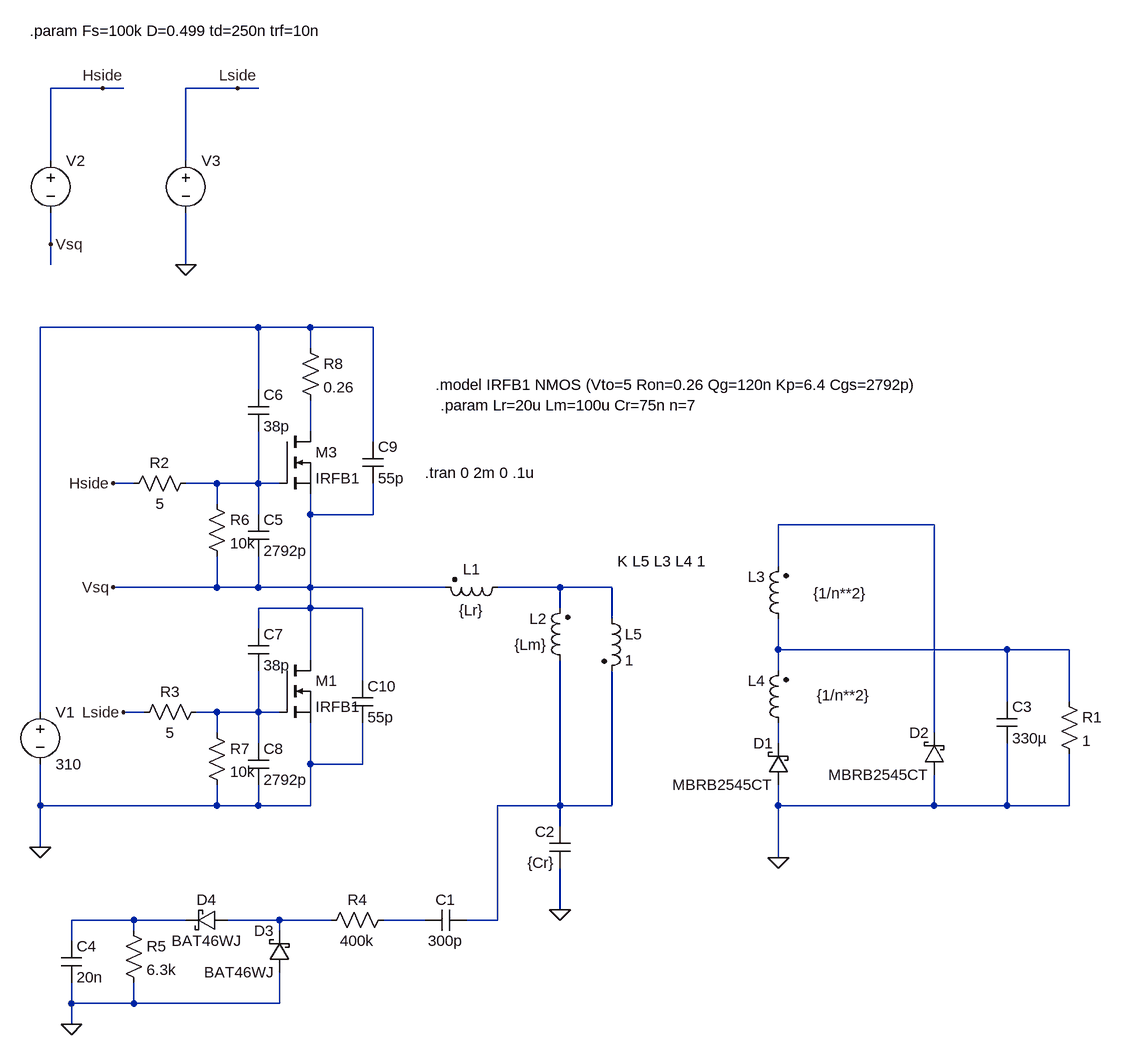
[diagram p0: schematic LLC_model.asc]
LLC_model.asc, the LTspice schematic file:
Version 4
SHEET 1 1512 680
WIRE -96 -864 -176 -864
WIRE -64 -864 -96 -864
WIRE 112 -864 32 -864
WIRE 144 -864 112 -864
WIRE -176 -752 -176 -864
WIRE 32 -752 32 -864
WIRE -176 -624 -176 -672
WIRE -176 -592 -176 -624
WIRE 32 -592 32 -672
WIRE 144 -496 -192 -496
WIRE 224 -496 144 -496
WIRE 320 -496 224 -496
WIRE 224 -464 224 -496
WIRE 144 -400 144 -496
WIRE 224 -336 224 -384
WIRE 320 -320 320 -496
WIRE -48 -256 -80 -256
WIRE 80 -256 32 -256
WIRE 144 -256 144 -336
WIRE 144 -256 80 -256
WIRE 176 -256 144 -256
WIRE 80 -224 80 -256
WIRE 144 -208 144 -256
WIRE 224 -208 224 -240
WIRE 320 -208 320 -256
WIRE 320 -208 224 -208
WIRE 1184 -192 944 -192
WIRE 944 -128 944 -192
WIRE 80 -96 80 -144
WIRE 80 -96 -80 -96
WIRE 144 -96 144 -144
WIRE 144 -96 80 -96
WIRE 224 -96 224 -208
WIRE 224 -96 144 -96
WIRE 432 -96 224 -96
WIRE 608 -96 512 -96
WIRE 688 -96 608 -96
WIRE 224 -64 224 -96
WIRE 224 -64 144 -64
WIRE 304 -64 224 -64
WIRE 608 -64 608 -96
WIRE 688 -48 688 -96
WIRE 144 -32 144 -64
WIRE 944 0 944 -48
WIRE 1296 0 944 0
WIRE 1392 0 1296 0
WIRE 224 16 224 -64
WIRE 944 32 944 0
WIRE 304 48 304 -64
WIRE 1296 80 1296 0
WIRE 1392 80 1392 0
WIRE -192 96 -192 -496
WIRE -32 96 -64 96
WIRE 80 96 48 96
WIRE 144 96 144 32
WIRE 144 96 80 96
WIRE 176 96 144 96
WIRE 80 128 80 96
WIRE 1184 128 1184 -192
WIRE 144 144 144 96
WIRE 944 144 944 112
WIRE 224 176 224 112
WIRE 304 176 304 112
WIRE 304 176 224 176
WIRE -192 240 -192 176
WIRE 80 240 80 208
WIRE 80 240 -192 240
WIRE 144 240 144 208
WIRE 144 240 80 240
WIRE 224 240 224 176
WIRE 224 240 144 240
WIRE 608 240 608 16
WIRE 608 240 512 240
WIRE 688 240 688 32
WIRE 688 240 608 240
WIRE 944 240 944 208
WIRE 1184 240 1184 192
WIRE 1184 240 944 240
WIRE 1296 240 1296 144
WIRE 1296 240 1184 240
WIRE 1392 240 1392 160
WIRE 1392 240 1296 240
WIRE 608 272 608 240
WIRE -192 304 -192 240
WIRE 944 320 944 240
WIRE 608 400 608 336
WIRE -48 416 -144 416
WIRE 32 416 -48 416
WIRE 176 416 96 416
WIRE 256 416 176 416
WIRE 400 416 336 416
WIRE 512 416 512 240
WIRE 512 416 464 416
WIRE -48 432 -48 416
WIRE 176 432 176 416
WIRE -144 448 -144 416
WIRE -144 544 -144 512
WIRE -48 544 -48 512
WIRE -48 544 -144 544
WIRE 176 544 176 496
WIRE 176 544 -48 544
WIRE -144 576 -144 544
FLAG -192 304 0
FLAG -176 -624 Vsq
FLAG -96 -864 Hside
FLAG 112 -864 Lside
FLAG 32 -592 0
FLAG -80 -256 Hside
FLAG -64 96 Lside
FLAG -80 -96 Vsq
FLAG 608 400 0
FLAG 944 320 0
FLAG -144 576 0
SYMBOL voltage -192 80 R0
WINDOW 123 0 0 Left 0
WINDOW 39 0 0 Left 0
SYMATTR InstName V1
SYMATTR Value 310
SYMBOL voltage -176 -768 R0
WINDOW 3 24 96 Invisible 2
WINDOW 123 0 0 Left 0
WINDOW 39 0 0 Left 0
SYMATTR Value PULSE(0 15 0 {trf} {trf} {D/Fs-td} {1/Fs})
SYMATTR InstName V2
SYMBOL voltage 32 -768 R0
WINDOW 3 24 96 Invisible 2
WINDOW 123 0 0 Left 0
WINDOW 39 0 0 Left 0
SYMATTR Value PULSE(0 15 {D/Fs} {trf} {trf} {(1-D)/Fs-td} {1/Fs})
SYMATTR InstName V3
SYMBOL res 48 -272 R90
WINDOW 0 0 56 VBottom 2
WINDOW 3 32 56 VTop 2
SYMATTR InstName R2
SYMATTR Value 5
SYMBOL res 64 80 R90
WINDOW 0 0 56 VBottom 2
WINDOW 3 32 56 VTop 2
SYMATTR InstName R3
SYMATTR Value 5
SYMBOL ind2 624 32 R180
WINDOW 0 36 80 Left 2
WINDOW 3 36 40 Left 2
SYMATTR InstName L2
SYMATTR Value {Lm}
SYMATTR Type ind
SYMBOL ind2 960 -32 R180
WINDOW 0 36 80 Left 2
WINDOW 3 -120 55 Left 2
SYMATTR InstName L3
SYMATTR Value {1/n**2}
SYMATTR Type ind
SYMBOL ind2 960 128 R180
WINDOW 0 36 80 Left 2
WINDOW 3 -125 58 Left 2
SYMATTR InstName L4
SYMATTR Value {1/n**2}
SYMATTR Type ind
SYMBOL schottky 1200 192 R180
WINDOW 0 24 64 Left 2
WINDOW 3 24 0 Left 2
SYMATTR InstName D2
SYMATTR Value MBRB2545CT
SYMATTR Description Diode
SYMATTR Type diode
SYMBOL res 1376 64 R0
SYMATTR InstName R1
SYMATTR Value 1
SYMBOL ind2 528 -112 R90
WINDOW 0 4 56 VBottom 2
WINDOW 3 36 56 VTop 2
SYMATTR InstName L1
SYMATTR Value {Lr}
SYMATTR Type ind
SYMATTR SpiceLine Rser=10m
SYMBOL cap 1280 80 R0
SYMATTR InstName C3
SYMATTR Value 330µ
SYMATTR SpiceLine Rser=3m
SYMBOL nmos 176 -336 R0
SYMATTR InstName M3
SYMATTR Value IRFB1
SYMBOL schottky 960 208 R180
WINDOW 0 24 64 Left 2
WINDOW 3 24 0 Left 2
SYMATTR InstName D1
SYMATTR Value MBRB2545CT
SYMATTR Description Diode
SYMATTR Type diode
SYMBOL nmos 176 16 R0
SYMATTR InstName M1
SYMATTR Value IRFB1
SYMBOL ind2 672 -64 R0
SYMATTR InstName L5
SYMATTR Value 1
SYMATTR Type ind
SYMBOL cap 624 336 R180
WINDOW 0 24 56 Left 2
WINDOW 3 24 8 Left 2
SYMATTR InstName C2
SYMATTR Value {Cr}
SYMATTR SpiceLine Rser=3m
SYMBOL cap 464 400 R90
WINDOW 0 0 32 VBottom 2
WINDOW 3 32 32 VTop 2
SYMATTR InstName C1
SYMATTR Value 300p
SYMBOL res 352 400 R90
WINDOW 0 0 56 VBottom 2
WINDOW 3 32 56 VTop 2
SYMATTR InstName R4
SYMATTR Value 400k
SYMBOL schottky 192 496 R180
WINDOW 0 24 64 Left 2
WINDOW 3 24 0 Left 2
SYMATTR InstName D3
SYMATTR Value BAT46WJ
SYMATTR Description Diode
SYMATTR Type diode
SYMBOL res -64 416 R0
SYMATTR InstName R5
SYMATTR Value 6.3k
SYMBOL cap -160 448 R0
SYMATTR InstName C4
SYMATTR Value 20n
SYMBOL schottky 96 400 R90
WINDOW 0 0 32 VBottom 2
WINDOW 3 32 32 VTop 2
SYMATTR InstName D4
SYMATTR Value BAT46WJ
SYMATTR Description Diode
SYMATTR Type diode
SYMBOL cap 128 -208 R0
SYMATTR InstName C5
SYMATTR Value 2792p
SYMBOL cap 128 -400 R0
SYMATTR InstName C6
SYMATTR Value 38p
SYMBOL cap 128 -32 R0
SYMATTR InstName C7
SYMATTR Value 38p
SYMBOL cap 128 144 R0
SYMATTR InstName C8
SYMATTR Value 2792p
SYMBOL cap 304 -320 R0
SYMATTR InstName C9
SYMATTR Value 55p
SYMBOL cap 288 48 R0
SYMATTR InstName C10
SYMATTR Value 55p
SYMBOL res 64 -240 R0
SYMATTR InstName R6
SYMATTR Value 10k
SYMBOL res 64 112 R0
SYMATTR InstName R7
SYMATTR Value 10k
SYMBOL res 208 -480 R0
SYMATTR InstName R8
SYMATTR Value 0.26
TEXT 416 -408 Left 2 !.model IRFB1 NMOS (Vto=5 Ron=0.26 Qg=120n Kp=6.4 Cgs=2792p)
TEXT 400 -272 Left 2 !.tran 0 2m 0 .1u
TEXT -208 -952 Left 2 !.param Fs=100k D=0.499 td=250n trf=10n
TEXT 424 -376 Left 2 !.param Lr=20u Lm=100u Cr=75n n=7
TEXT 696 -136 Left 2 !K L5 L3 L4 1

The netlist it stands for:
* LLC_model.asc
V1 N001 0 310
V2 Hside Vsq PULSE(0 15 0 {trf} {trf} {D/Fs-td} {1/Fs})
V3 Lside 0 PULSE(0 15 {D/Fs} {trf} {trf} {(1-D)/Fs-td} {1/Fs})
R2 N003 Hside 5
R3 N007 Lside 5
L2 N009 N005 {Lm}
L3 N006 N004 {1/n**2}
L4 N008 N006 {1/n**2}
D2 0 N004 MBRB2545CT
R1 N006 0 1
L1 N005 Vsq {Lr} Rser=10m
C3 N006 0 330µ Rser=3m
M3 N002 N003 Vsq Vsq IRFB1
D1 0 N008 MBRB2545CT
M1 Vsq N007 0 0 IRFB1
L5 N005 N009 1
C2 0 N009 {Cr} Rser=3m
C1 N009 N012 300p
R4 N012 N011 400k
D3 0 N011 BAT46WJ
R5 N010 0 6.3k
C4 N010 0 20n
D4 N011 N010 BAT46WJ
C5 N003 Vsq 2792p
C6 N001 N003 38p
C7 Vsq N007 38p
C8 N007 0 2792p
C9 N001 Vsq 55p
C10 Vsq 0 55p
R6 N003 Vsq 10k
R7 N007 0 10k
R8 N001 N002 0.26
.model D D
.lib standard.dio
.model NMOS NMOS
.model PMOS PMOS
.lib standard.mos
.model IRFB1 NMOS (Vto=5 Ron=0.26 Qg=120n Kp=6.4 Cgs=2792p)
.tran 0 2m 0 .1u
.param Fs=100k D=0.499 td=250n trf=10n
.param Lr=20u Lm=100u Cr=75n n=7
K L5 L3 L4 1
.backanno
.end